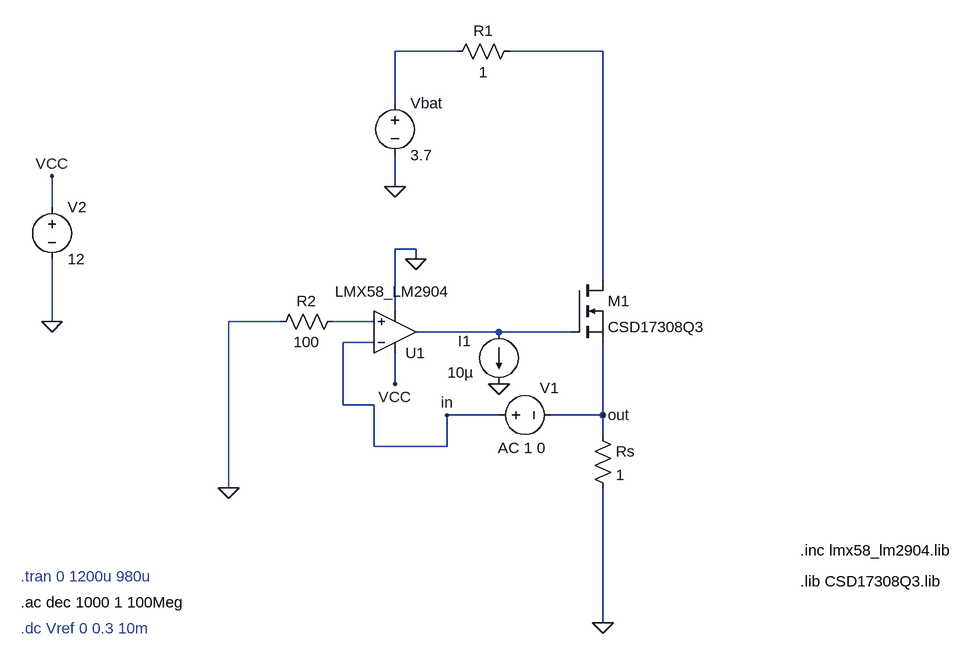
[diagram p0: schematic modulo_descarga_aol.asc]
modulo_descarga_aol.asc, the LTspice schematic file:
Version 4.1
SHEET 1 1700 680
WIRE 720 -912 624 -912
WIRE 944 -912 800 -912
WIRE 624 -832 624 -912
WIRE 624 -704 624 -752
WIRE 96 -672 96 -720
WIRE 656 -608 624 -608
WIRE 656 -592 656 -608
WIRE 944 -560 944 -912
WIRE 624 -512 624 -608
WIRE 96 -496 96 -592
WIRE 448 -496 368 -496
WIRE 592 -496 528 -496
WIRE 784 -480 656 -480
WIRE 896 -480 784 -480
WIRE 592 -464 544 -464
WIRE 624 -400 624 -448
WIRE 544 -368 544 -464
WIRE 592 -368 544 -368
WIRE 784 -352 704 -352
WIRE 944 -352 944 -464
WIRE 944 -352 864 -352
WIRE 944 -320 944 -352
WIRE 592 -304 592 -368
WIRE 704 -304 704 -352
WIRE 704 -304 592 -304
WIRE 368 -240 368 -496
WIRE 944 -32 944 -240
FLAG 944 -32 0
FLAG 96 -720 VCC
FLAG 96 -496 0
FLAG 624 -400 VCC
FLAG 368 -240 0
FLAG 624 -704 0
FLAG 656 -592 0
FLAG 784 -400 0
FLAG 704 -352 in
FLAG 944 -352 out
SYMBOL OpAmps\\opamp2 624 -416 M180
WINDOW 3 -92 126 Left 2
SYMATTR Value LMX58_LM2904
SYMATTR InstName U1
SYMBOL voltage 96 -688 R0
WINDOW 123 0 0 Left 0
WINDOW 39 0 0 Left 0
SYMATTR InstName V2
SYMATTR Value 12
SYMBOL res 928 -336 R0
SYMATTR InstName Rs
SYMATTR Value 1
SYMBOL voltage 624 -848 R0
WINDOW 123 0 0 Left 0
WINDOW 39 0 0 Left 0
SYMATTR InstName Vbat
SYMATTR Value 3.7
SYMBOL res 816 -928 R90
WINDOW 0 0 56 VBottom 2
WINDOW 3 32 56 VTop 2
SYMATTR InstName R1
SYMATTR Value 1
SYMBOL res 544 -512 R90
WINDOW 0 0 56 VBottom 2
WINDOW 3 32 56 VTop 2
SYMATTR InstName R2
SYMATTR Value 100
SYMBOL nmos 896 -560 R0
SYMATTR InstName M1
SYMATTR Value CSD17308Q3
SYMATTR Prefix x
SYMBOL voltage 768 -352 R270
WINDOW 0 26 94 VTop 2
WINDOW 3 -32 56 VBottom 2
WINDOW 123 -66 51 VTop 2
WINDOW 39 0 0 Left 0
SYMATTR InstName V1
SYMATTR Value ""
SYMATTR Value2 AC 1 0
SYMBOL current 784 -480 R0
WINDOW 0 -63 14 Left 2
WINDOW 3 -79 62 Left 2
WINDOW 123 0 0 Left 0
WINDOW 39 0 0 Left 0
SYMATTR InstName I1
SYMATTR Value 10µ
TEXT 1248 -144 Left 2 !.inc lmx58_lm2904.lib
TEXT 48 -104 Left 2 ;.tran 0 1200u 980u
TEXT 48 -64 Left 2 !.ac dec 1000 1 100Meg
TEXT 1248 -96 Left 2 !.lib CSD17308Q3.lib
TEXT 48 -24 Left 2 ;.dc Vref 0 0.3 10m

The netlist it stands for:
* modulo_descarga_aol.asc
X§U1 N003 in VCC 0 N004 LMX58_LM2904  ; pins In+ In- V+ V- OUT
V2 VCC 0 12
Rs out 0 1
Vbat N001 0 3.7
R1 N002 N001 1
R2 N003 0 100
X§M1 N002 N004 out CSD17308Q3  ; pins D G S
V1 in out AC 1 0
I1 N004 0 10µ
.inc lmx58_lm2904.lib
* .tran 0 1200u 980u
.ac dec 1000 1 100Meg
.lib CSD17308Q3.lib
* .dc Vref 0 0.3 10m
.backanno
.end